# EAGLE schematic NachtElk_DBL_PowerDistribution_3V3-5V (EAGLE 9.6.2)
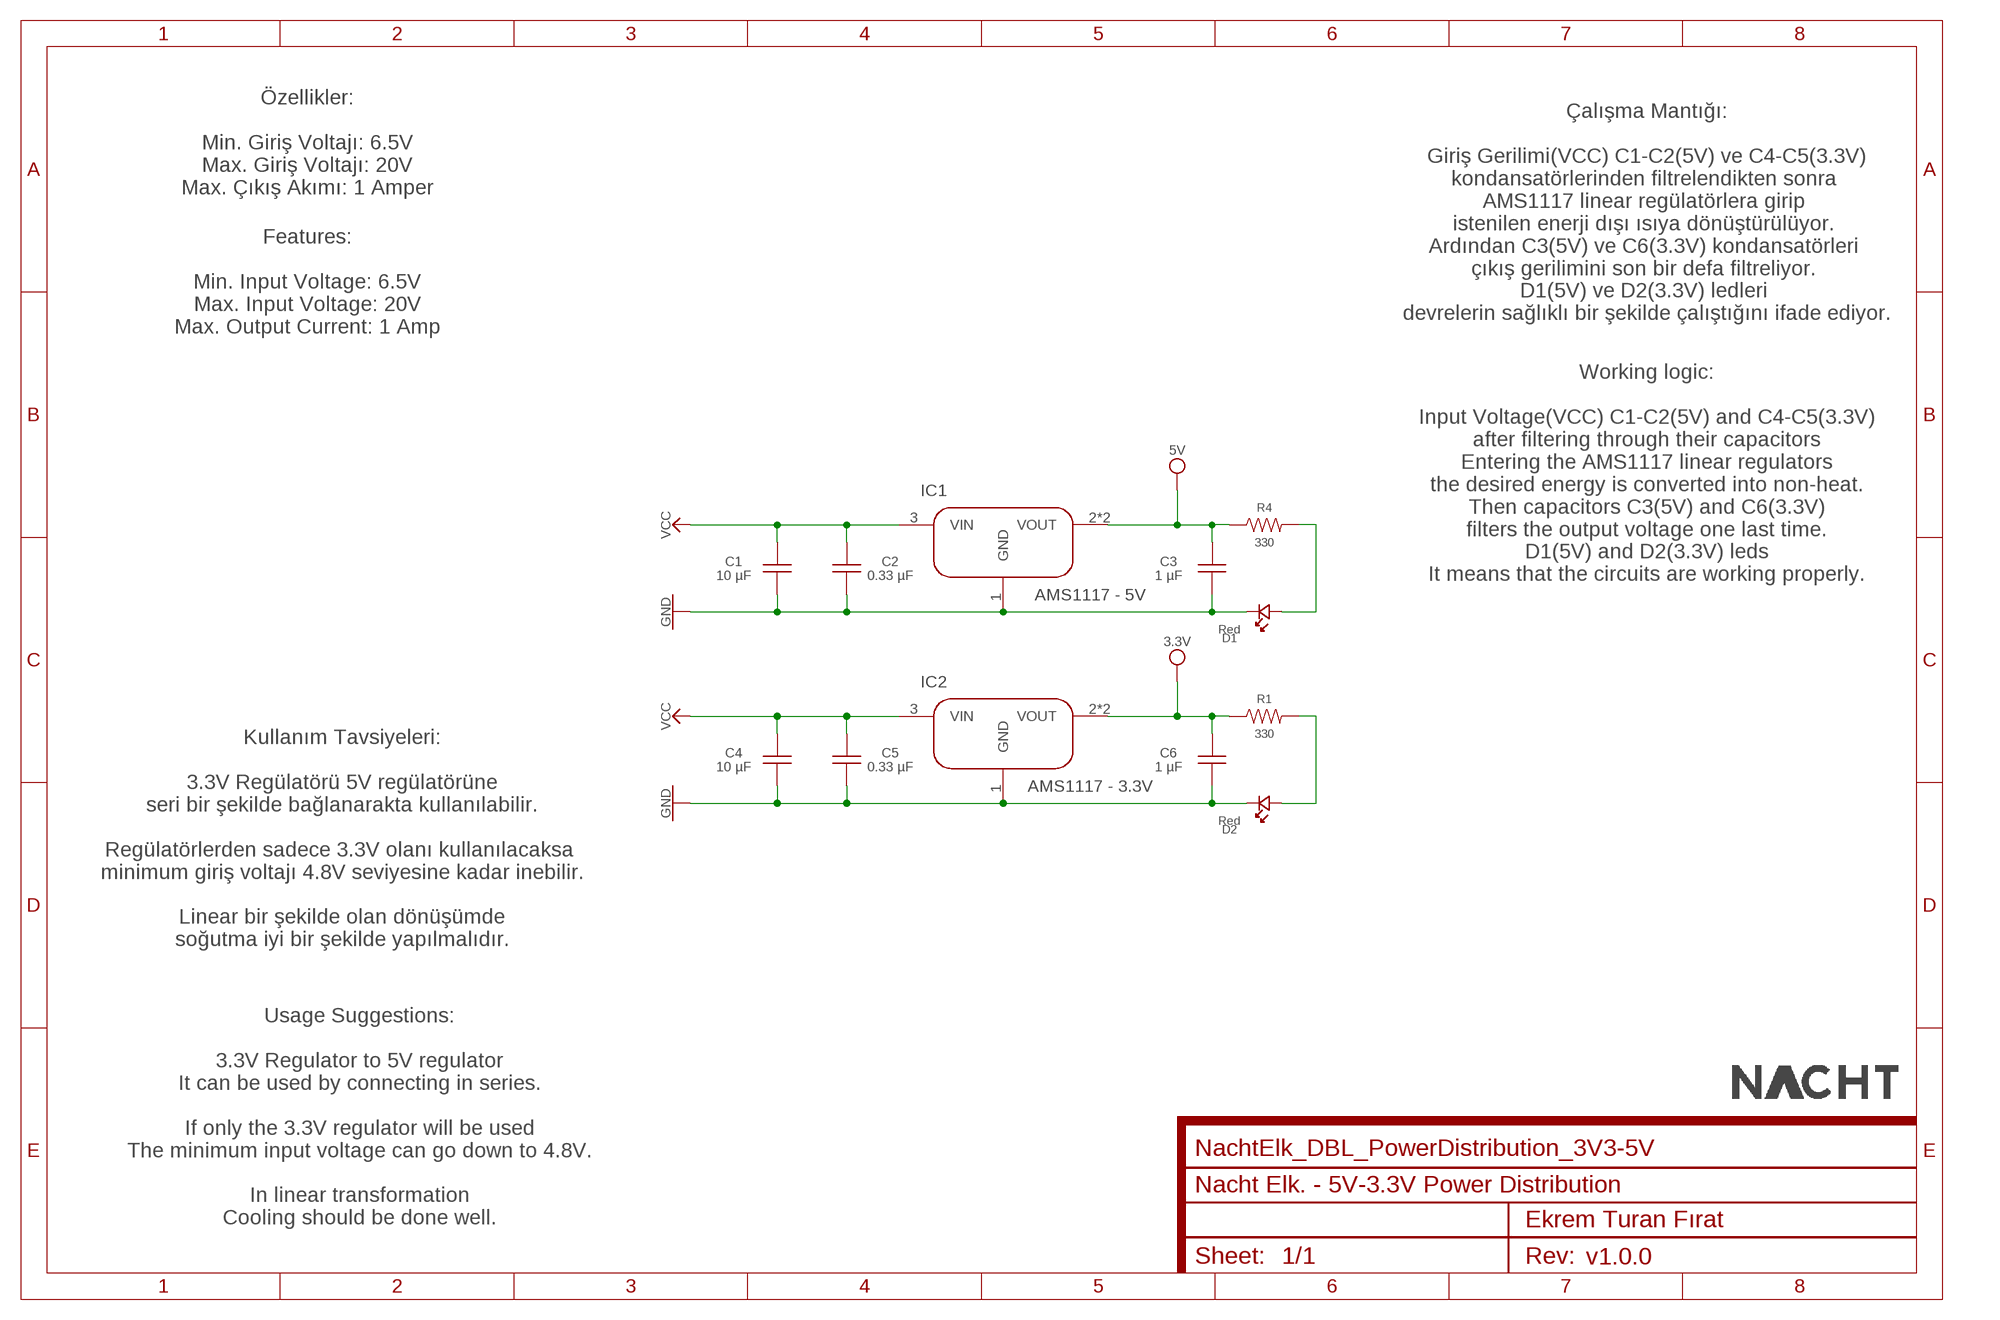
[diagram p0: schematic, sheet 1]
A4_PAGE2 (NACHTELK_AESTHETİCS_A4): DRAWING_DESCRIPTION: Nacht Elk. - 5V-3.3V Power Distribution; DRAWING_DESIGNER: Ekrem Turan Fırat; DRAWING_REVISION: v1.0.0

## Parts
C1  10 µF  NACHTELK_CAP-NONPOLAR-SMD_10UF_0603  [0603]
C2  0.33 µF  NACHTELK_CAP-NONPOLAR-SMD_0.33UF_0603  [0603]
C3  1 µF  NACHTELK_CAP-NONPOLAR-SMD_1UF_0603  [0603]
C4  10 µF  NACHTELK_CAP-NONPOLAR-SMD_10UF_0603  [0603]
C5  0.33 µF  NACHTELK_CAP-NONPOLAR-SMD_0.33UF_0603  [0603]
C6  1 µF  NACHTELK_CAP-NONPOLAR-SMD_1UF_0603  [0603]
D1  Red  NACHTELK_LED_SMD_0603_RED  [0603_RED]
D2  Red  NACHTELK_LED_SMD_0603_RED  [0603_RED]
IC1  AMS1117 - 5V  NACHTELK_LINEAR-REG_AMS1117_5V  [SOT-223]
IC2  AMS1117 - 3.3V  NACHTELK_LINEAR-REG_AMS1117_3.3V  [SOT-223]
R1  330  NACHTELK_RES-SMD_330R_0603  [0603]
R4  330  NACHTELK_RES-SMD_330R_0603  [0603]
U$1  NACHTELK_AESTHETICS_NACHTELK-LOGO_2X7  [NACHTELK_LOGO_2X7]

## Nets
3.3V: C6.1 IC2.2(VOUT) IC2.4(VOUT) R1.1
5V: C3.1 IC1.2(VOUT) IC1.4(VOUT) R4.1
GND: C1.2 C2.2 C3.2 C4.2 C5.2 C6.2 D1.2(KATOT) D2.2(KATOT) IC1.1(GND) IC2.1(GND)
N$1: D2.1(ANOT) R1.2
N$12: D1.1(ANOT) R4.2
VCC: C1.1 C2.1 C4.1 C5.1 IC1.3(VIN) IC2.3(VIN)

## Notes on the sheet
- Özellikler:
  
  Min. Giriş Voltajı: 6.5V
  Max. Giriş Voltajı: 20V
  Max. Çıkış Akımı: 1 Amper
- Çalışma Mantığı:
  
  Giriş Gerilimi(VCC) C1-C2(5V) ve C4-C5(3.3V)
  kondansatörlerinden filtrelendikten sonra 
  AMS1117 linear regülatörlera girip 
  istenilen enerji dışı ısıya dönüştürülüyor. 
  Ardından C3(5V) ve C6(3.3V) kondansatörleri 
  çıkış gerilimini son bir defa filtreliyor. 
  D1(5V) ve D2(3.3V) ledleri 
  devrelerin sağlıklı bir şekilde çalıştığını ifade ediyor.
- Features:
  
  Min. Input Voltage: 6.5V
  Max. Input Voltage: 20V
  Max. Output Current: 1 Amp
- Working logic:
  
  Input Voltage(VCC) C1-C2(5V) and C4-C5(3.3V)
  after filtering through their capacitors
  Entering the AMS1117 linear regulators
  the desired energy is converted into non-heat.
  Then capacitors C3(5V) and C6(3.3V)
  filters the output voltage one last time.
  D1(5V) and D2(3.3V) leds
  It means that the circuits are working properly.
- Kullanım Tavsiyeleri:
  
  3.3V Regülatörü 5V regülatörüne
  seri bir şekilde bağlanarakta kullanılabilir.
  
  Regülatörlerden sadece 3.3V olanı kullanılacaksa 
  minimum giriş voltajı 4.8V seviyesine kadar inebilir.
  
  Linear bir şekilde olan dönüşümde
  soğutma iyi bir şekilde yapılmalıdır.
- Usage Suggestions:
  
  3.3V Regulator to 5V regulator
  It can be used by connecting in series.
  
  If only the 3.3V regulator will be used
  The minimum input voltage can go down to 4.8V.
  
  In linear transformation
  Cooling should be done well.

## Library data of the parts
C1 C4 = NachtElk_CapacitorsCeramic_SMD:NACHTELK_CAP-NONPOLAR-SMD: Nacht Elk. - Ceramic Capacitors Ekrem Turan Fırat Nacht Elk. - Ceramic Capacitors Value: 1pF - 100 µF Maximum operating voltage: 6.3V - 10V - 16V - 25V - 50V Tolerance: 10% -20% Operating temperature: -55 °C up to +125°C Mount Type: SMD Package: 0402 - 0603(1608) - 0805(2012) - 1210 01.02.2022; DIGI-KEY_NUMBER: 490-12323-1-ND; MOUNT-TYPE: SMD; PACKAGE: 0603(1806); PART-NUMBER: GRT188R61E106ME13D; TEMPERATURE: -55 °C up to +185°C; TOLERANCE: 10%; VOLTAGE: 25V
C2 C5 = NachtElk_CapacitorsCeramic_SMD:NACHTELK_CAP-NONPOLAR-SMD: Nacht Elk. - Ceramic Capacitors Ekrem Turan Fırat Nacht Elk. - Ceramic Capacitors Value: 1pF - 100 µF Maximum operating voltage: 6.3V - 10V - 16V - 25V - 50V Tolerance: 10% -20% Operating temperature: -55 °C up to +125°C Mount Type: SMD Package: 0402 - 0603(1608) - 0805(2012) - 1210 01.02.2022; DIGI-KEY_NUMBER: 445-5950-1-ND; MOUNT-TYPE: SMD; PACKAGE: 0603(1806); PART-NUMBER: C1608X7R1H334K080AC; TEMPERATURE: -55 °C up to +125°C; TOLERANCE: 10%; VOLTAGE: 50V
C3 C6 = NachtElk_CapacitorsCeramic_SMD:NACHTELK_CAP-NONPOLAR-SMD: Nacht Elk. - Ceramic Capacitors Ekrem Turan Fırat Nacht Elk. - Ceramic Capacitors Value: 1pF - 100 µF Maximum operating voltage: 6.3V - 10V - 16V - 25V - 50V Tolerance: 10% -20% Operating temperature: -55 °C up to +125°C Mount Type: SMD Package: 0402 - 0603(1608) - 0805(2012) - 1210 01.02.2022; DIGI-KEY_NUMBER: 1276-1860-1-ND; MOUNT-TYPE: SMD; PACKAGE: 0603(1806); PART-NUMBER: CL10A105KB8NNNC; TEMPERATURE: -55 °C up to +85°C; TOLERANCE: 10%; VOLTAGE: 50V
D1 D2 = NachtElk_Leds_SMD:NACHTELK_LED_SMD: Nacht Elk. - LEDs SMD Ekrem Turan Fırat Nacht Elk. - Resistor SMD Color: White - Blue - Green - Red Operating temperature: -40 °C up to +85°C Package: 0402 - 0603(1608) - 0805 - 1206 - 2810 - 2835 - 3020 - 3528 - 5630 - 5050 08.04.2022; DIGI-KEY_NUMBER: 732-4978-1-ND; MOUNT-TYPE: SMD; PACKAGE: 0603(1608); PART-NUMBER: 150060RS75000; TEMPERATURE: -40 °C up to +85°C; VOLTAGE: 3.3V
IC1 = NachtElk_LinearRegs:NACHTELK_LINEAR-REG_AMS1117: Nacht Elk. - Linear Voltage Regulators Ekrem Turan Fırat Nacht Elk. - AMS1117 Output Voltage Range: 1.2V - 5V - ADJ Max Output Current: 1A Max. Input Voltage: 18V Operating temperature: -20 °C up to +125°C Package: SOT-223 Mount Type: SMD Datasheet <https://cdn.ozdisan.com/ETicaret_Dosya/348307_6210366.pdf> 04.02.2022; AMP: 1A; DIGI-KEY_NUMBER: NCP1117ST50T3GOSCT-ND; INPUT: >6.5V; OUTPUT: 5V; PACKAGE: SOT-223; PART-NUMBER: NCP1117ST50T3G; TEMPERATURE: 0 °C up to +125°C
IC2 = NachtElk_LinearRegs:NACHTELK_LINEAR-REG_AMS1117: Nacht Elk. - Linear Voltage Regulators Ekrem Turan Fırat Nacht Elk. - AMS1117 Output Voltage Range: 1.2V - 5V - ADJ Max Output Current: 1A Max. Input Voltage: 18V Operating temperature: -20 °C up to +125°C Package: SOT-223 Mount Type: SMD Datasheet <https://cdn.ozdisan.com/ETicaret_Dosya/348307_6210366.pdf> 04.02.2022; AMP: 1A; DIGI-KEY_NUMBER: NCP1117ST33T3GOSCT-ND; INPUT: >4.9V; OUTPUT: 3.3V; PACKAGE: SOT-223; PART-NUMBER: NCP1117ST33T3G; TEMPERATURE: 0 °C up to +125°C
R1 R4 = NachtElk_Resistors_SMD:NACHTELK_RES-SMD: Nacht Elk. - Resistor SMD Ekrem Turan Fırat Nacht Elk. - Resistor SMD Value: 1/8W - 1/10W 0R - 2.2MR Tolerance: %1 - %5 Operating temperature: -55 °C up to +155°C Package: 0402 - 0603(1608) - 0805 - 1206 - 1210 - 2010 - 2512 25.12.2021; DIGI-KEY_NUMBER: RMCF0603JT330RCT-ND; MOUNT-TYPE: SMD; PACKAGE: 0603(1608); PART-NUMBER: RMCF0603JT330R; POWER: 1/10W; TEMPERATURE: -55 °C up to +155°C; TOLERANCE: %5
U$1 = NachtElk_Aesthetics:NACHTELK_AESTHETICS_NACHTELK-LOGO: Nacht Elk. - Aesthetics Ekrem Turan Fırat Nacht Elk. Logo 05x3 - 15x70 mm